# Altium schematic sheet Hexrotor Joint Splitter.SchDoc
size A; SheetNumber: 1; SheetTotal: 1
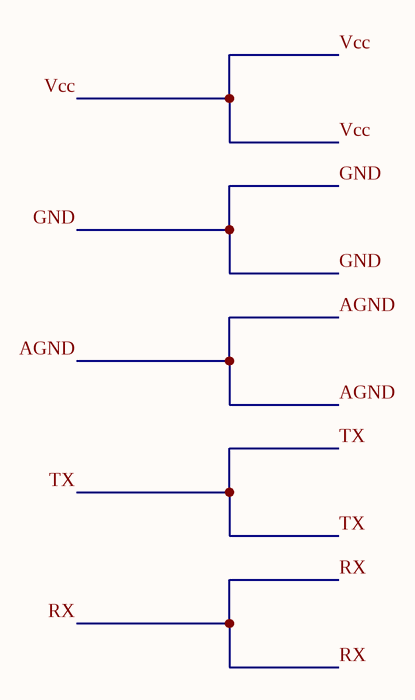
[diagram p0: Hexrotor Joint Splitter.SchDoc]